# EAGLE schematic BeanShield (EAGLE 7.3.0)
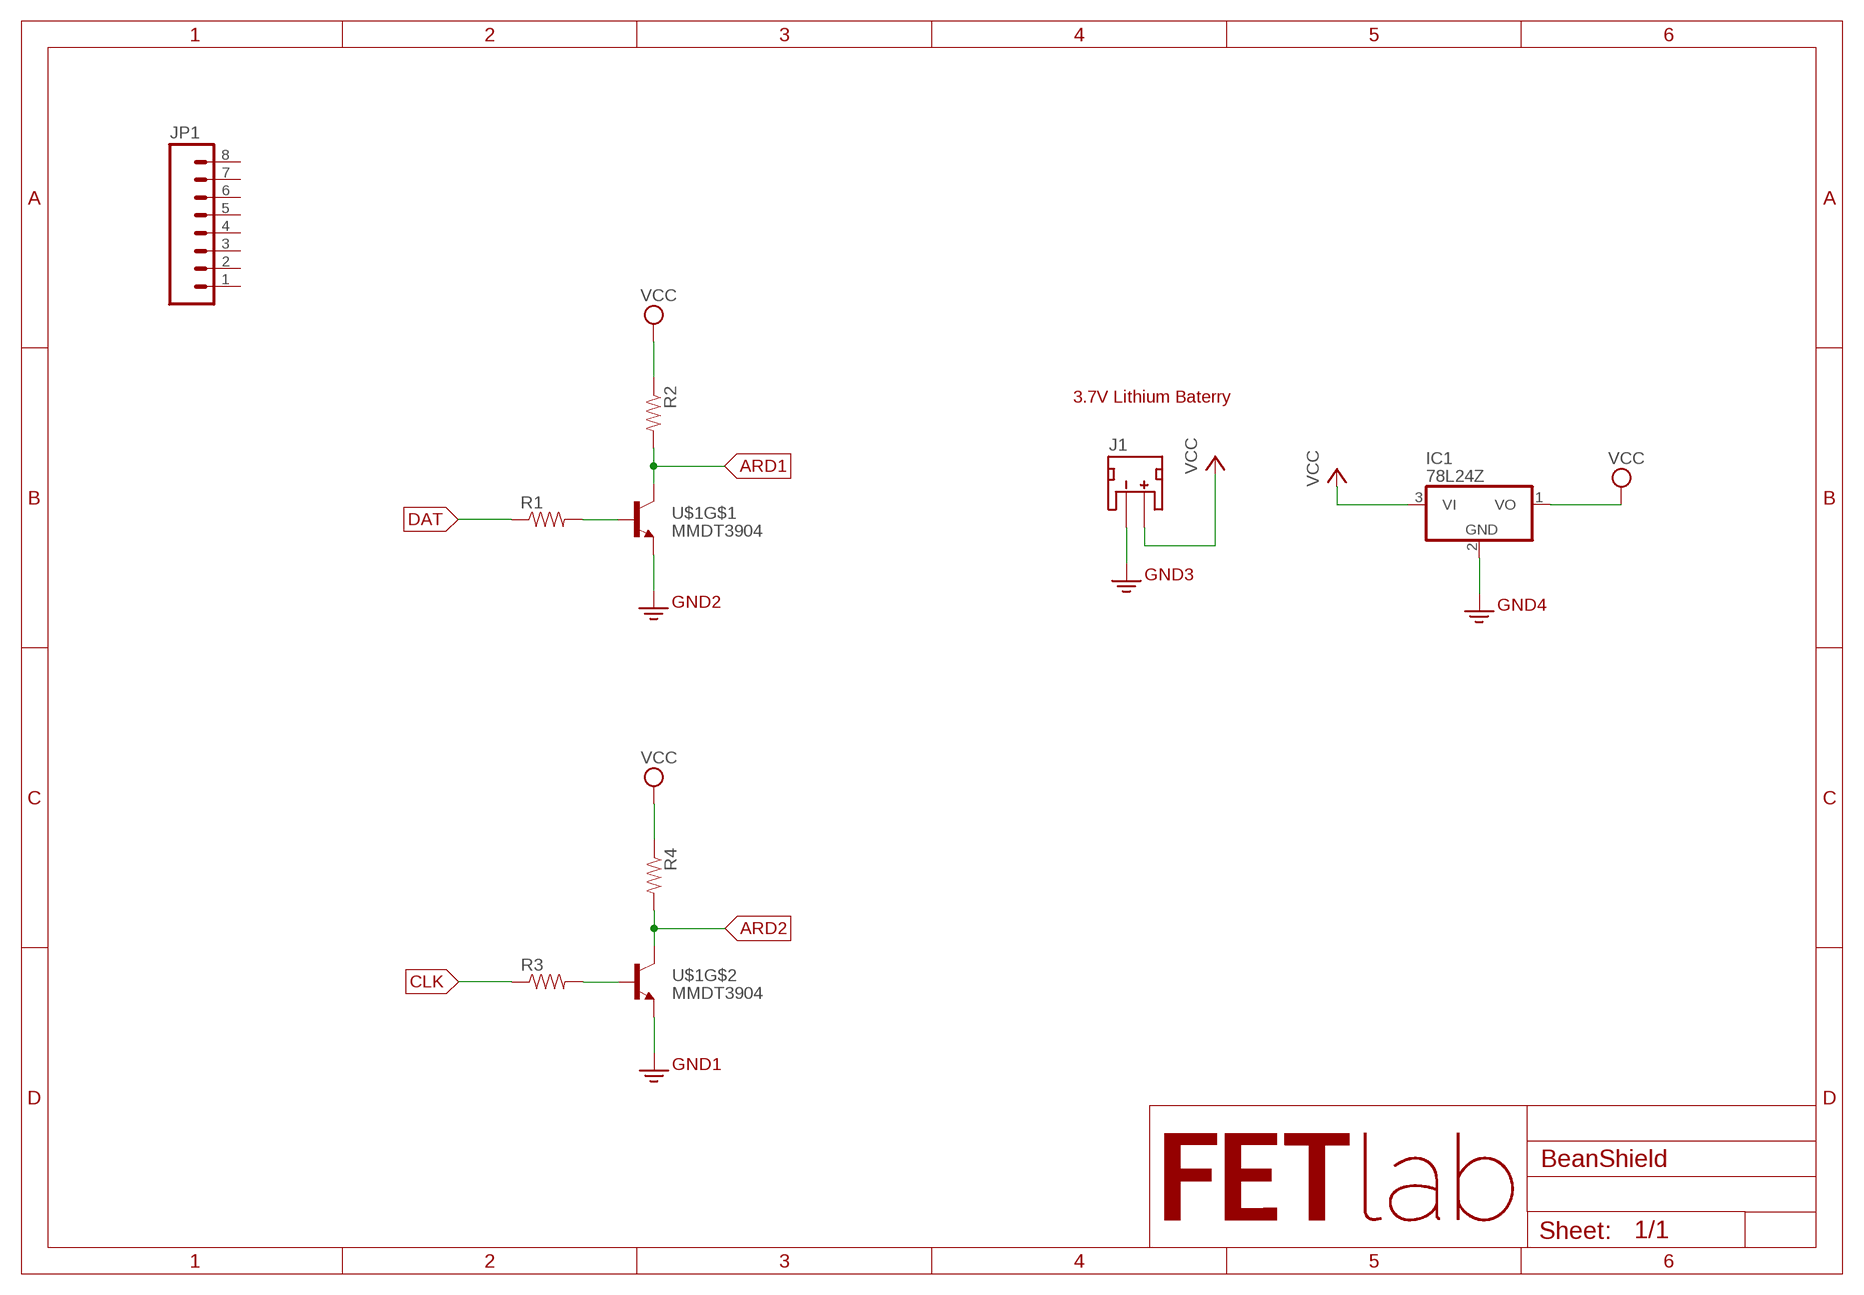
[diagram p0: schematic, sheet 1]

## Parts
IC1  78L24Z  [TO92]
J1  JST_2MM_MALE  [JST-2-SMD]
JP1  M08  [1X08_ROUND]
R1  RESISTOR0402  [0402-RES]
R2  RESISTOR0402  [0402-RES]
R3  RESISTOR0402  [0402-RES]
R4  RESISTOR0402  [0402-RES]
U$1  MMDT3904  TRANSISTOR_NPN2UPMMDT3904  [SOT363]

## Nets
3.3V: IC1.2(GND) J1.1(-) U$1.1(E) U$1.4(E) ; supply symbol labelled GND2
ARD1: R2.2 U$1.6(C)
ARD2: R4.2 U$1.3(C)
CLK: R3.1
DAT: R1.1
N$1: R1.2 U$1.2(B)
N$3: R3.2 U$1.5(B)
VCC: IC1.1(VO) IC1.3(VI) J1.2(+) R2.1 R4.1
Unconnected: J1.NC1(PAD1) J1.NC2(PAD2) JP1.1 JP1.2 JP1.3 JP1.4 JP1.5 JP1.6 JP1.7 JP1.8

## Notes on the sheet
- 3.7V Lithium Baterry
- /Users/oaf7862/Documents/eagle_fetlab.bmp

## Library data of the parts
IC1 = adafruit:78*: Positive VOLTAGE REGULATOR Added bigger pads to the TO-92 package
J1 = SparkFun-Connectors:JST_2MM_MALE: Mates to single-cell LiPo batteries. CONN-11443 Now with smashable polarity marks!; BTM_NEG: -; BTM_POS: +; PROD_ID: CONN-11443; TOP_NEG: -; TOP_POS: +
JP1 = SparkFun-Connectors:M08: Header 8 Standard 8-pin 0.1" header. Use with straight break away headers (SKU : PRT-00116), right angle break away headers (PRT-00553), swiss pins (PRT-00743), machine pins (PRT-00117), and female headers (PRT-00115).; PROD_ID: CONN-08437
R1-R4 = SparkFun-Resistors:RESISTOR: Resistor Basic schematic elements and footprints for 0603, 1206, and PTH resistors.
U$1 = SparkFun-DiscreteSemi:TRANSISTOR_NPN2UP: 2-up package of NPN transistors MMDT3904- TRANS-09373 (SOT-363, 200mA 40V); PROD_ID: TRANS-09373